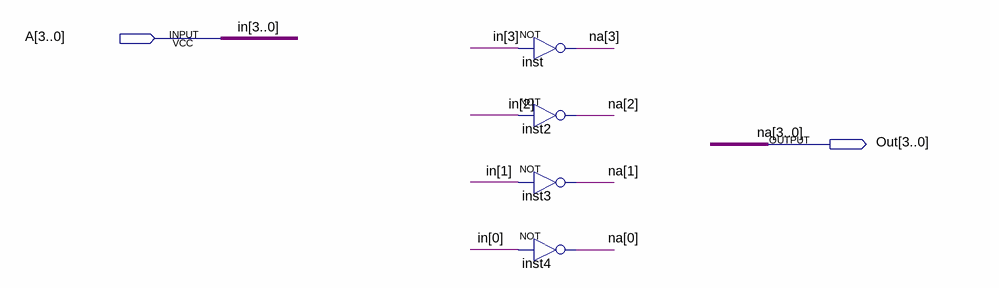
[diagram p0: schematic sheet]
// Quartus schematic bigNot.bdf as structural Verilog: 4 symbols, 2 pins
module bigNot (
  input  [3:0] A,
  output [3:0] Out
);

  not inst (Out[3], A[3]);
  not inst2 (Out[2], A[2]);
  not inst3 (Out[1], A[1]);
  not inst4 (Out[0], A[0]);

  // Other names for the same wires on the sheet: in[3:0] = A; na[3:0] = Out
endmodule
